# Altium schematic sheet LAN9254_B_P1.SchDoc
size 431 x 279 mm; DocumentNumber: 12; SheetNumber: 6; SheetTotal: 13
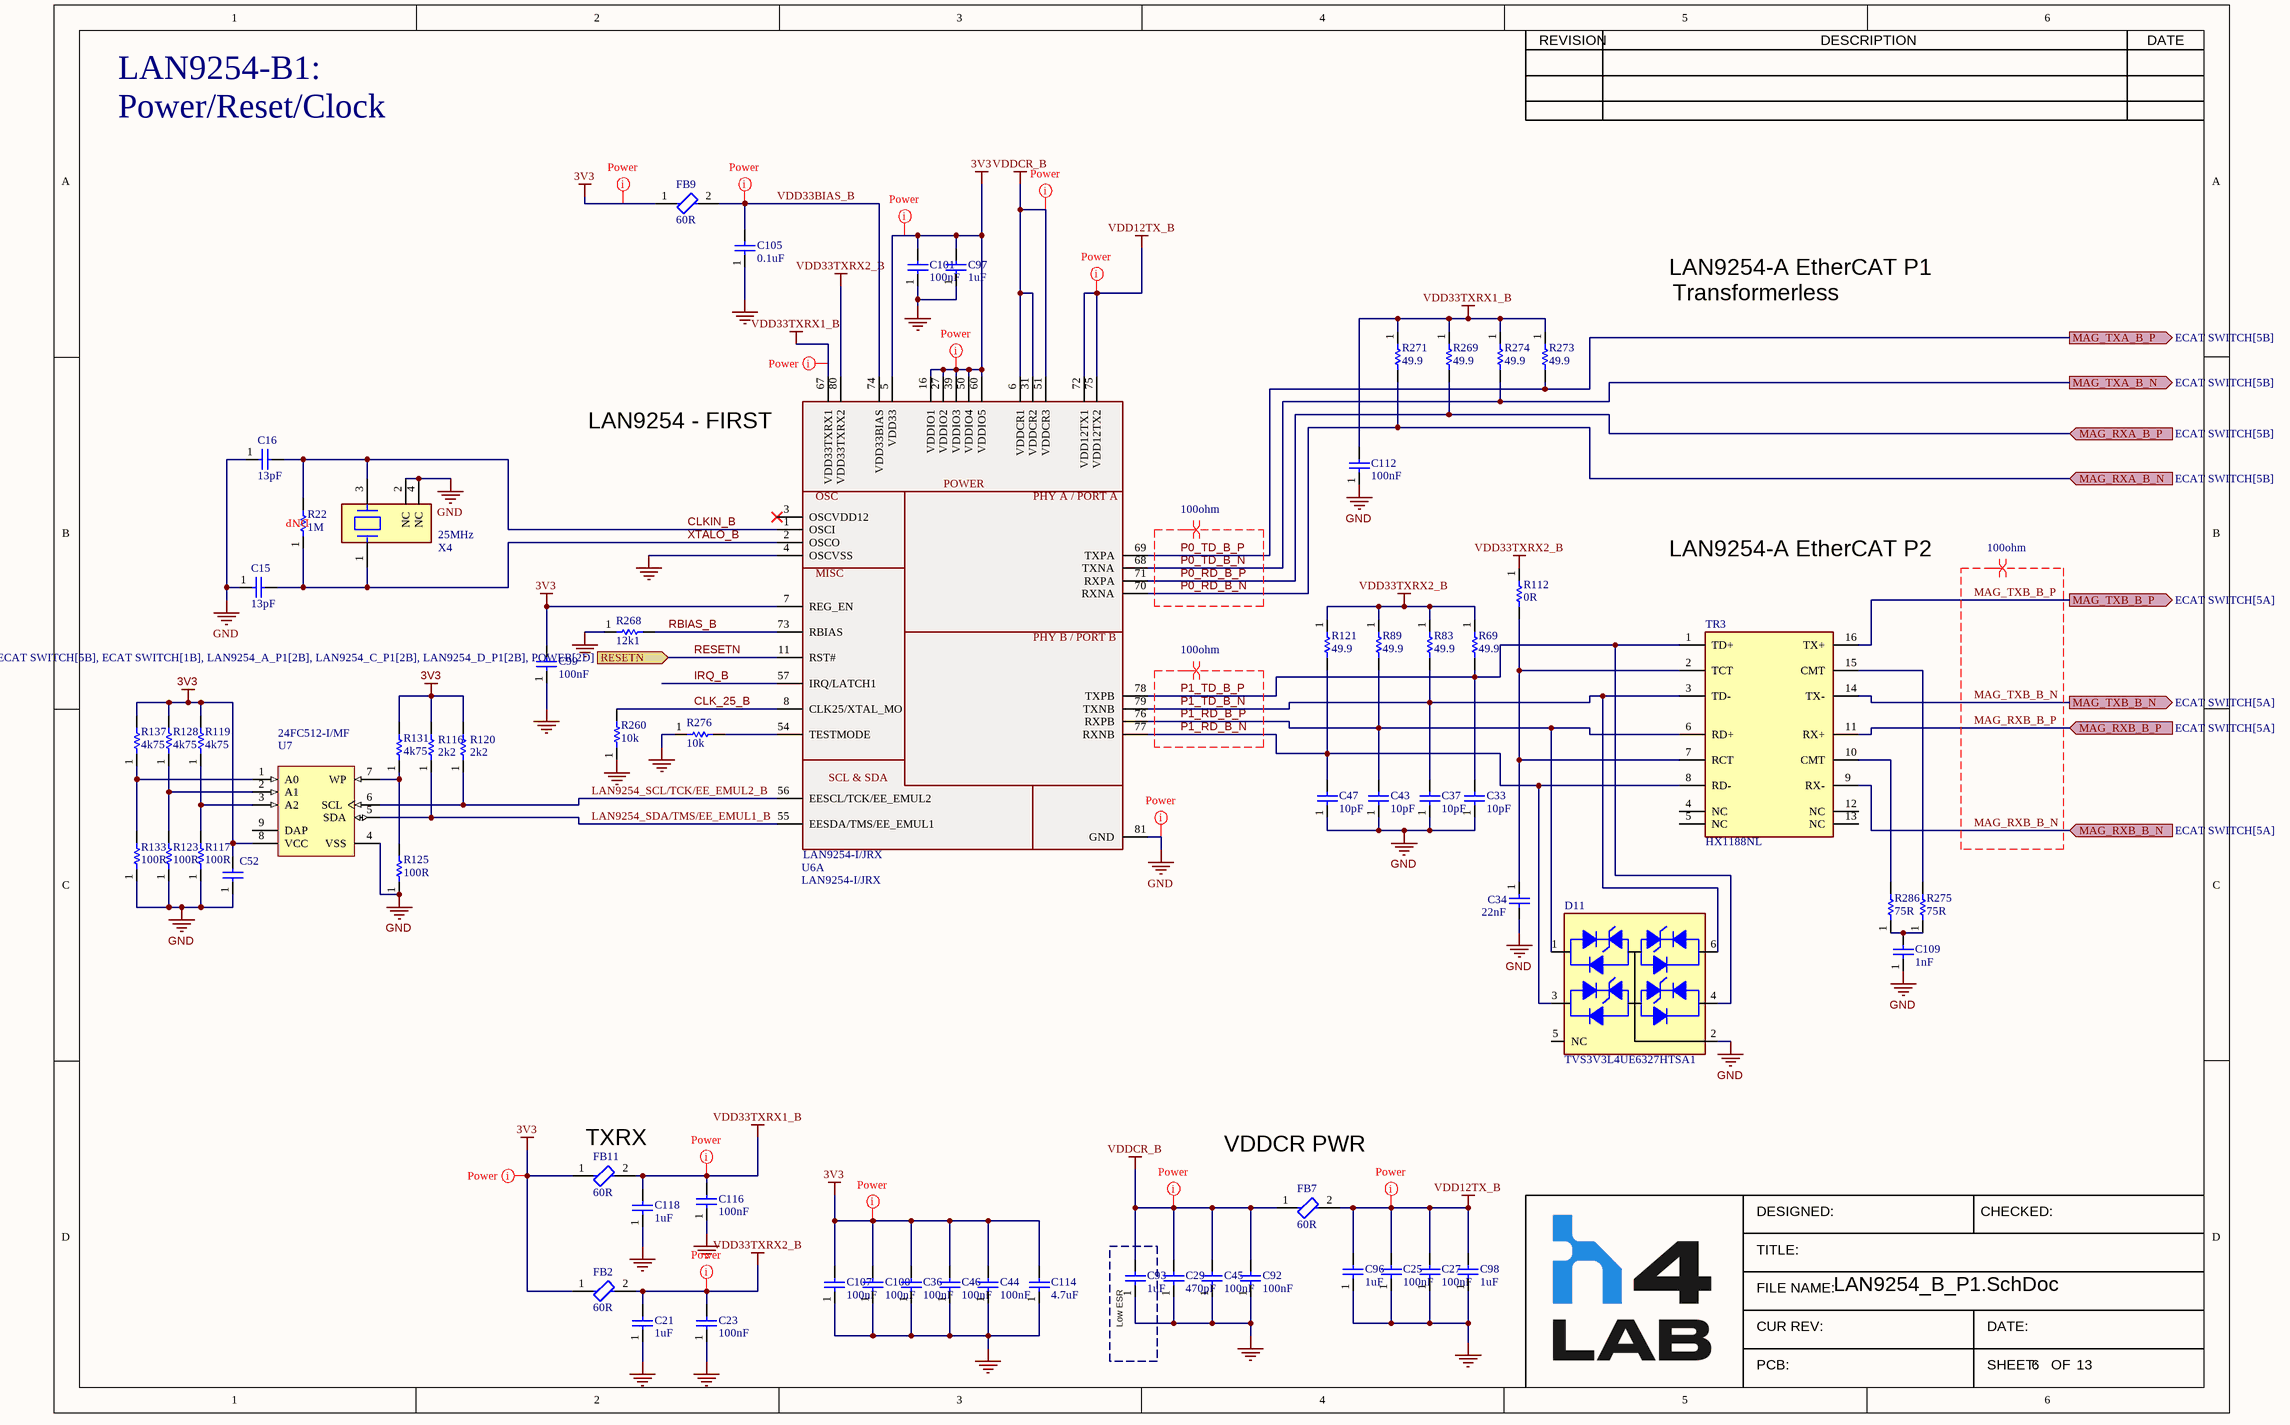
[diagram p0: LAN9254_B_P1.SchDoc]

## Parts
C15  value 13pF  [0402_C]  (hidden comment: GRM0225C1H130GA03L)
C16  value 13pF  [0402_C]  (hidden comment: GRM0225C1H130GA03L)
C21  value 1uF  [CAPC1608X09N(0603)]  (hidden comment: C0603C105K3PACTU)
C23  value 100nF  [CAPC1005X03N(0402)]  (hidden comment: GRM155R71C104JA88D)
C25  value 100nF  [CAPC1005X03N(0402)]  (hidden comment: GRM155R71C104JA88D)
C27  value 100nF  [CAPC1005X03N(0402)]  (hidden comment: GRM155R71C104JA88D)
C29  value 470pF  [CAPC1005X03N(0402)]  (hidden comment: GCM1555C1H471JA16D)
C33  value 10pF  [0402_C]  (hidden comment: C0402C100J5GAC7411)
C34  value 22nF  [CAPC1005X03N(0402)]  (hidden comment: GCM155R71H223KA55D)
C36  value 100nF  [CAPC1005X03N(0402)]  (hidden comment: GRM155R71C104JA88D)
C37  value 10pF  [0402_C]  (hidden comment: C0402C100J5GAC7411)
C43  value 10pF  [0402_C]  (hidden comment: C0402C100J5GAC7411)
C44  value 100nF  [CAPC1005X03N(0402)]  (hidden comment: GRM155R71C104JA88D)
C45  value 100nF  [CAPC1005X03N(0402)]  (hidden comment: GRM155R71C104JA88D)
C46  value 100nF  [CAPC1005X03N(0402)]  (hidden comment: GRM155R71C104JA88D)
C47  value 10pF  [0402_C]  (hidden comment: C0402C100J5GAC7411)
C52  GRM155R71C104JA88D  [CAPC1005X03N(0402)]  (value not drawn)
C92  value 100nF  [CAPC1005X03N(0402)]  (hidden comment: GRM155R71C104JA88D)
C93  value 1uF  [0603_C]  (hidden comment: LMK107BJ105KA-T)
C96  value 1uF  [CAPC1608X09N(0603)]  (hidden comment: C0603C105K3PACTU)
C97  value 1uF  [0603_C]  (hidden comment: LMK107BJ105KA-T)
C98  value 1uF  [CAPC1608X09N(0603)]  (hidden comment: C0603C105K3PACTU)
C99  value 100nF  [CAPC1005X03N(0402)]  (hidden comment: GRM155R71C104JA88D)
C100  value 100nF  [CAPC1005X03N(0402)]  (hidden comment: GRM155R71C104JA88D)
C101  value 100nF  [CAPC1005X03N(0402)]  (hidden comment: GRM155R71C104JA88D)
C105  value 0.1uF  [CAPC1608X09N(0603)]  (hidden comment: CL10B104KC8NNNC)
C107  value 100nF  [CAPC1005X03N(0402)]  (hidden comment: GRM155R71C104JA88D)
C109  value 1nF  [CAPC3216X16N(1206)]  (hidden comment: CC1206KKX7RDBB102)
C112  value 100nF  [CAPC1005X03N(0402)]  (hidden comment: GRM155R71C104JA88D)
C114  value 4.7uF  [CAPC3216X16N(1206)]  (hidden comment: CL31B475KBHNNNE)
C116  value 100nF  [CAPC1005X03N(0402)]  (hidden comment: GRM155R71C104JA88D)
C118  value 1uF  [CAPC1608X09N(0603)]  (hidden comment: C0603C105K3PACTU)
D11  TVS3V3L4UE6327HTSA1  [FP-SOT457-MFG]
FB2  Impedance: 60R  [FP-BKP2125-IPC_C]  (hidden comment: BKP2125HS600-T)
FB7  Impedance: 60R  [FP-BKP2125-IPC_C]  (hidden comment: BKP2125HS600-T)
FB9  Impedance: 60R  [FP-BKP2125-IPC_C]  (hidden comment: BKP2125HS600-T)
FB11  Impedance: 60R  [FP-BKP2125-IPC_C]  (hidden comment: BKP2125HS600-T)
R22  value 1M  [RESC1608X09N(0603)]  (hidden comment: RC0603FR-071ML)
R69  value 49.9  [RESC1005X06N(0402)]  (hidden comment: CRCW040249R9FKED)
R83  value 49.9  [RESC1005X06N(0402)]  (hidden comment: CRCW040249R9FKED)
R89  value 49.9  [RESC1005X06N(0402)]  (hidden comment: CRCW040249R9FKED)
R112  value 0R  [0402]  (hidden comment: RCS04020000Z0ED)
R116  value 2k2  [0402]  (hidden comment: CRCW04022K20JNED)
R117  value 100R  [0402]  (hidden comment: CRGCQ0402F100R)
R119  value 4k75  [RESC1005X06N(0402)]  (hidden comment: RC0402FR-074K75L)
R120  value 2k2  [0402]  (hidden comment: CRCW04022K20JNED)
R121  value 49.9  [RESC1005X06N(0402)]  (hidden comment: CRCW040249R9FKED)
R123  value 100R  [0402]  (hidden comment: CRGCQ0402F100R)
R125  value 100R  [0402]  (hidden comment: CRGCQ0402F100R)
R128  value 4k75  [RESC1005X06N(0402)]  (hidden comment: RC0402FR-074K75L)
R131  value 4k75  [RESC1005X06N(0402)]  (hidden comment: RC0402FR-074K75L)
R133  value 100R  [0402]  (hidden comment: CRGCQ0402F100R)
R137  value 4k75  [RESC1005X06N(0402)]  (hidden comment: RC0402FR-074K75L)
R260  value 10k  [RESC1005X06N(0402)]  (hidden comment: RC0402FR-0710KL)
R268  value 12k1  [RESC1005X06N(0402)]  (hidden comment: RC0402FR-0712K1L)
R269  value 49.9  [RESC1005X06N(0402)]  (hidden comment: CRCW040249R9FKED)
R271  value 49.9  [RESC1005X06N(0402)]  (hidden comment: CRCW040249R9FKED)
R273  value 49.9  [RESC1005X06N(0402)]  (hidden comment: CRCW040249R9FKED)
R274  value 49.9  [RESC1005X06N(0402)]  (hidden comment: CRCW040249R9FKED)
R275  value 75R  [RESC1005X06N(0402)]  (hidden comment: CRCW040275R0FKEDC)
R276  value 10k  [RESC1005X06N(0402)]  (hidden comment: RC0402FR-0710KL)
R286  value 75R  [RESC1005X06N(0402)]  (hidden comment: CRCW040275R0FKEDC)
TR3  HX1188NL  [FP-HX1188NL-MFG]
U6  LAN9254-I/JRX  [QFP50P1400X1400X120-81N]  (part A of 2)
U7  24FC512-I/MF  [DFNS-MF8]
X4  Frequency: 25MHz  [FP-XRCGB-MFG]  (hidden comment: XRCGB25M000F3A00R0)

## Blocks framed on the sheet
Low ESR: C93

## Ports
MAG_RXA_B_N (in, see ECAT SWITCH[5B]), MAG_RXA_B_P (in, see ECAT SWITCH[5B]), MAG_RXB_B_N (in, see ECAT SWITCH[5A]), MAG_RXB_B_P (in, see ECAT SWITCH[5A]), MAG_TXA_B_N (out, see ECAT SWITCH[5B]), MAG_TXA_B_P (out, see ECAT SWITCH[5B]), MAG_TXB_B_N (out, see ECAT SWITCH[5A]), MAG_TXB_B_P (out, see ECAT SWITCH[5A]), RESETN (in, see ECAT SWITCH[5B], ECAT SWITCH[1B], LAN9254_A_P1[2B], LAN9254_C_P1[2B], LAN9254_D_P1[2B], POWER[2D])

## Nets
3V3: C36.2 C44.2 C46.2 C52.2 C97.2 C99.2 C100.2 C101.2 C107.2 C114.2 FB2.1 FB9.1 FB11.1 R116.2 R119.2 R120.2 R128.2 R131.2 R137.2 U6.5(VDD33) U6.7(REG_EN) U6.16(VDDIO1) U6.27(VDDIO2) U6.39(VDDIO3) U6.50(VDDIO4) U6.60(VDDIO5) U7.8(VCC)
GND: C15.1 C16.1 C21.1 C23.1 C25.1 C27.1 C29.1 C33.1 C34.2 C36.1 C37.1 C43.1 C44.1 C45.1 C46.1 C47.1 C52.1 C92.1 C93.1 C96.1 C97.1 C98.1 C99.1 C100.1 C101.1 C105.1 C107.1 C109.1 C112.1 C114.1 C116.1 C118.1 D11.2(GND) R117.1 R123.1 R125.1 R133.1 R260.1 R268.1 R276.1 U6.4(OSCVSS) U6.81(GND) U7.4(VSS) X4.2(NC) X4.4(NC)
VDD12TX_B: C25.2 C27.2 C96.2 C98.2 FB7.2 U6.72(VDD12TX1) U6.75(VDD12TX2)
VDD33TXRX1_B: C112.2 C116.2 C118.2 FB11.2 R269.1 R271.1 R273.1 R274.1 U6.67(VDD33TXRX1)
VDD33TXRX2_B: C21.2 C23.2 FB2.2 R69.1 R83.1 R89.1 R112.1 R121.1 U6.80(VDD33TXRX2)
VDDCR_B: C29.2 C45.2 C92.2 C93.2 FB7.1 U6.6(VDDCR1) U6.31(VDDCR2) U6.51(VDDCR3)
CLK_25_B: R260.2 U6.8(CLK25/XTAL_MO)
CLKIN_B: C16.2 R22.2 U6.1(OSCI) X4.3
IRQ_B: U6.57(IRQ/LATCH1)
LAN9254_SCL/TCK/EE_EMUL2_B: R120.1 U6.56(EESCL/TCK/EE_EMUL2) U7.6(SCL)
LAN9254_SDA/TMS/EE_EMUL1_B: R116.1 U6.55(EESDA/TMS/EE_EMUL1) U7.5(SDA)
MAG_RXB_B_N: TR3.9(RX-) ; port MAG_RXB_B_N
MAG_RXB_B_P: TR3.11(RX+) ; port MAG_RXB_B_P
MAG_TXB_B_N: TR3.14(TX-) ; port MAG_TXB_B_N
MAG_TXB_B_P: TR3.16(TX+) ; port MAG_TXB_B_P
P0_RD_B_N: R271.2 U6.70(RXNA) ; port MAG_RXA_B_N
P0_RD_B_P: R269.2 U6.71(RXPA) ; port MAG_RXA_B_P
P0_TD_B_N: R274.2 U6.68(TXNA) ; port MAG_TXA_B_N
P0_TD_B_P: R273.2 U6.69(TXPA) ; port MAG_TXA_B_P
P1_RD_B_N: C47.2 D11.3 R121.2 TR3.8(RD-) U6.77(RXNB)
P1_RD_B_P: C43.2 D11.1 R89.2 TR3.6(RD+) U6.76(RXPB)
P1_TD_B_N: C37.2 D11.6 R83.2 TR3.3(TD-) U6.79(TXNB)
P1_TD_B_P: C33.2 D11.4 R69.2 TR3.1(TD+) U6.78(TXPB)
RBIAS_B: R268.2 U6.73(RBIAS)
RESETN: U6.11(RST#) ; port RESETN
VDD33BIAS_B: C105.2 FB9.2 U6.74(VDD33BIAS)
XTALO_B: C15.2 R22.1 U6.2(OSCO) X4.1
NetC34_1: C34.1 R112.2 TR3.2(TCT) TR3.7(RCT)
NetC109_2: C109.2 R275.1 R286.1
NetR117_2: R117.2 R119.1 U7.3(A2)
NetR123_2: R123.2 R128.1 U7.2(A1)
NetR125_2: R125.2 R131.1 U7.7(WP)
NetR133_2: R133.2 R137.1 U7.1(A0)
NetR275_2: R275.2 TR3.15(CMT)
NetR276_2: R276.2 U6.54(TESTMODE)
NetR286_2: R286.2 TR3.10(CMT)

Not connected (* = marked no-connect by the designer): D11 5(NC); TR3 4(NC) 5(NC) 12(NC) 13(NC); U6 3(OSCVDD12)*; U7 9(DAP)

## Layout directives
net class Power: 3V3, GND, VDD12TX_B, VDD33BIAS_B, VDD33TXRX1_B, VDD33TXRX2_B, VDDCR_B
differential pair; differential pair class 100ohm: MAG_RXB_B_N, MAG_RXB_B_P, MAG_TXB_B_N, MAG_TXB_B_P, P0_RD_B_N, P0_RD_B_P, P0_TD_B_N, P0_TD_B_P, P1_RD_B_N, P1_RD_B_P, P1_TD_B_N, P1_TD_B_P

## Notes on the sheet
- LAN9254-B1:
- Power/Reset/Clock
- Transformerless
- LAN9254-A EtherCAT P1
- (near U6) LAN9254 - FIRST
- (near R22) DNP
- LAN9254-A EtherCAT P2
- (near FB11) TXRX
- VDDCR PWR
- REVISION
- DESCRIPTION
- DATE
- DESIGNED:
- CHECKED:
- TITLE:
- FILE NAME:
- CUR REV:
- PCB:
- SHEET:
- DATE:
- OF
- (in symbol LAN9254-I/JRX, part A) POWER; OSC; PHY A / PORT A; MISC; PHY B / PORT B; SCL & SDA

## Library data of the parts
C15 C16 = 13pF_50V_0402_CAP_GRM0225C1H130GA03L: Cap Ceramic Monolithic 13pF 50VDC 2% SMD Emboss T/R; Manufacturer: Murata; Supplier 1: Digi-Key; Manufacturer Part Number: GRM0225C1H130GA03L; RoHS: Yes; Category: Ceramic Capacitors; Pricing 1: 40000=0.01108 (USD); RoHS Compliant: Yes; Supplier Part Number 1: 490-GRM0225C1H130GA03LTR-ND
C21 C96 C98 C118 = 1uF_25VDC_0603_Cap: MLCC - SMD/SMT 25volts 1uF X5R 10%; Voltage: 25VDC; Drawn By: TC; MPN: C0603C105K3PACTU; Tolerance: 10%; Supplier 1: Mouser; Supplier Part Number 1: 80-C0603C105K3PAC
C23 C25 C27 C36 C44-C46 C92 C99-C101 C107 C112 C116 = 100nF_16V_0402_CAP: CAP CER 0.1UF 16V X7R 0402; Tolerance: 5%; MPN: GRM155R71C104JA88D; Voltage Rating: 16V; Temp Coeff: X7R; Size/Package: 0402
C29 = 470pF_50V_0402_CAP: CAP CER 470PF 50V C0G/NP0 0402; Tolerance: 5%; Temp Coeff: C0G, NP0; MPN: GCM1555C1H471JA16D; Voltage: 50V; Size: 0402
C33 C37 C43 C47 = 10pF_50V_0402_C0402C100J5GAC7411: Cap Ceramic 10pF 50V C0G 5% SMD 0402 125°C Punched Paper T/R; Manufacturer: KEMET; Tolerance: 5%; Supplier 1: Digi-Key; Supplier Part Number 1: 399-C0402C100J5GAC7411CT-ND; Manufacturer Part Number: C0402C100J5GAC7411; RoHS: Yes; Category: Ceramic Capacitors; Stock 1: 39987; Pricing 1: 1=0.10000, 10=0.03500, 50=0.01940, 100=0.01580, 500=0.01128, 1000=0.00886, 2500=0.00805, 5000=0.00741 (USD); Case/Package: 0402; Dielectric Material: Ceramic; Min Operating Temperature: -55°C; Max Operating Temperature: 125°C; Packaging: Tape and Reel; Capacitance: 10pF; Dielectric: C0G; Voltage Rating (DC): 50V; Length: 1mm; Depth: 0.5mm; Lead Free: Lead Free; RoHS Compliant: Yes; ComponentLink1URL: http://components.arrow.com/part/dataview/0323_00309912?src-supplier=Arrow+Europe; ComponentLink1Description: http://components.arrow.com/part/dataview/0323_00309912?src-supplier=Arrow+Europe
C34 = 22nF_50V_0402_CAP: CAP CER 0.022UF 50V X7R 0402; Tolerance: 10%; MPN: GCM155R71H223KA55D; Voltage Rating: 50V; Temp Coeff: X7R; Size/Package: 0402; Mounting Type: Surface Mounting
C52 = 100nF_16V_0402_CAP: CAP CER 0.1UF 16V X7R 0402; Value: 100nF; Tolerance: 5%; MPN: GRM155R71C104JA88D; Voltage Rating: 16V; Temp Coeff: X7R; Size/Package: 0402
C93 C97 = 1uF_10V_low_ESR_0603_LMK107BJ105KA-T: Multilayer Ceramic Capacitors (High dielectric type), 10V, 1 uF, ± 10 %, 0603, X5R, RoHS; Manufacturer: Taiyo Yuden; Tolerance: 10%; Supplier 1: Digi-Key; Supplier Part Number 1: 587-4281-1-ND; Manufacturer Part Number: LMK107BJ105KA-T; RoHS: Yes; Category: Ceramic Capacitors; Stock 1: 254397; Pricing 1: 1=0.10000, 10=0.05800, 50=0.03180, 100=0.02590, 500=0.01852, 1000=0.01455 (USD); Mount: Surface Mount; Case/Package: 0603; Case Code (Imperial): 0603; Case Code (Metric): 1608; Min Operating Temperature: -55°C; Max Operating Temperature: 85°C; Packaging: Tape and Reel; Capacitance: 1uF; Voltage Rating (DC): 10V; Dielectric: X5R; Package Quantity: 4000; Voltage Rating: 10V; Termination: SMD/SMT; Resistor Type: Ceramic; Series: M; Construction: Flat; Length: 1.6mm; Width: 0.8mm; Height: 0.8mm; Thickness: 0.035inch; Depth: 0.8mm; Radiation Hardening: No; Lead Free: Lead Free; Halogen Free: Halogen Free; RoHS Compliant: Yes; ComponentLink1URL: https://datasheet.ciiva.com/11596/lmk107bj105ka-t-ss-11596793.pdf?src-supplier=Avnet; ComponentLink1Description: https://datasheet.ciiva.com/11596/lmk107bj105ka-t-ss-11596793.pdf?src-supplier=Avnet; ComponentLink2URL: https://datasheet.ciiva.com/15921/1054lmk107bj105ka-t-15921296.pdf?src-supplier=Onlinecomponents.com; ComponentLink2Description: https://datasheet.ciiva.com/15921/1054lmk107bj105ka-t-15921296.pdf?src-supplier=Onlinecomponents.com; ComponentLink3URL: https://datasheet.ciiva.com/26872/getdatasheetpartid-637529-26872638.pdf?src-supplier=Verical; ComponentLink3Description: https://datasheet.ciiva.com/26872/getdatasheetpartid-637529-26872638.pdf?src-supplier=Verical; ComponentLink4URL: https://datasheet.ciiva.com/30232/584lmk107bj105ka-t-30232760.pdf?src-supplier=Onlinecomponents.com; ComponentLink4Description: https://datasheet.ciiva.com/30232/584lmk107bj105ka-t-30232760.pdf?src-supplier=Onlinecomponents.com
C105 = 0.1uF_100V_0603_CAP: CAP CER 0.1UF 100V X7R 0603; Tolerance: 10%; MPN: CL10B104KC8NNNC; Supplier 1: Digi-Key; Supplier Part Number 1: 1276-6807-1-ND; Volage Rating: 100V; Temp Coefficent: X7R; Mounting Type: Surface Mount; Case/Package: 0603
C109 = 1nF_2kV_1206_CAP: CAP CER 1000PF 2KV X7R 1206; Tolerance: 10%; Voltage Rating: 2kV; MPN: CC1206KKX7RDBB102; Temp Coeff: X7R; Size/Package: 1206
C114 = 4.7uF_50V_1206_CAP: CAP CER 4.7UF 50V X7R 1206; Tolerance: 10%; MPN: CL31B475KBHNNNE; Voltage: 50V; Temp Coeff: X7R; Package/Case: 1206
D11 = TVS_DIODE_ETHERCAT_PHY_7.7V_20A_TVS3V3L4UE6327HTSA1: Trans Voltage Suppressor Diode, 3.3V V(RWM), Unidirectional, 4 Element, Silicon; Manufacturer: Infineon; Supplier: Digi-Key; Supplier Part Number: TVS3V3L4UE6327HTSA1CT-ND; Manufacturer Part Number: TVS3V3L4UE6327HTSA1; RoHS: Yes; Category: Diodes; Stock: 273244; Pricing: 1=0.54, 10=0.438, 100=0.2981, 500=0.22356, 1000=0.16767 (USD); Terminal Finish: Tin; Diode Type: TRANS VOLTAGE SUPPRESSOR; Moisture Sensitivity Level: 1; JESD-609 Code: e3; Reach SVHC Compliant: Yes; RoHS Compliant: Yes; ComponentLink1URL: https://datasheet.ciiva.com:443/pdfs/VipMasterIC/IC/INFN/INFNS19177/INFNS19177-1.pdf?src-supplier=IHS+Markit; ComponentLink1Description: https://datasheet.ciiva.com:443/pdfs/VipMasterIC/IC/INFN/INFNS19177/INFNS19177-1.pdf?src-supplier=IHS+Markit; ComponentLink2URL: http://www.farnell.com/datasheets/1945807.pdf?src-supplier=Farnell; ComponentLink2Description: http://www.farnell.com/datasheets/1945807.pdf?src-supplier=Farnell; ComponentLink3URL: http://www.mouser.com/ds/2/196/Infineon-TVS3V3L4U-DS-v02_04-en-469488.pdf?src-supplier=Mouser; ComponentLink3Description: http://www.mouser.com/ds/2/196/Infineon-TVS3V3L4U-DS-v02_04-en-469488.pdf?src-supplier=Mouser; ComponentLink4URL: http://www.farnell.com/datasheets/1945807.pdf?src-supplier=Element14; ComponentLink4Description: http://www.farnell.com/datasheets/1945807.pdf?src-supplier=Element14; ComponentLink5URL: http://www.farnell.com/datasheets/1945807.pdf?src-supplier=Newark; ComponentLink5Description: http://www.farnell.com/datasheets/1945807.pdf?src-supplier=Newark; ComponentLink6URL: http://www.infineon.com/dgdl/Infineon-TVS3V3L4U-DS-v02_04-en.pdf?fileId=db3a3043382e837301385be7912532ed&src-supplier=Avnet; ComponentLink6Description: http://www.infineon.com/dgdl/Infineon-TVS3V3L4U-DS-v02_04-en.pdf?fileId=db3a3043382e837301385be7912532ed&src-supplier=Avnet; ComponentLink7URL: https://www.infineon.com/dgdl/TVS3V3L4U_rev_2_2.pdf?folderId=db3a30431f848401011fcbf2ab4c04c4&fileId=db3a3043382e837301385be7912532ed&src-supplier=Digi-Key; ComponentLink7Description: https://www.infineon.com/dgdl/TVS3V3L4U_rev_2_2.pdf?folderId=db3a30431f848401011fcbf2ab4c04c4&fileId=db3a3043382e837301385be7912532ed&src-supplier=Digi-Key; ComponentLink8URL: https://www.infineon.com/dgdl/TVS3V3L4U_rev_2_2.pdf?folderId=db3a30431f848401011fcbf2ab4c04c4&amp;fileId=db3a3043382e837301385be7912532ed&src-supplier=Digi-Key; ComponentLink8Description: https://www.infineon.com/dgdl/TVS3V3L4U_rev_2_2.pdf?folderId=db3a30431f848401011fcbf2ab4c04c4&amp;fileId=db3a3043382e837301385be7912532ed&src-supplier=Digi-Key
FB2 FB7 FB9 FB11 = 60R_100Mhz_0805_3A: TAIYO YUDEN - BKP2125HS600-T - Ferrite Bead, 0805 [2012 Metric], 60 ohm, 3 A, BKP Series, 0.025 ohm, ± 25%; Max DC Current: 3A; Number of Lines: 1; DC Resistance (DCR): 25mR; Test Frequency: 100MHz; Shielding: Unshielded; Packaging: Tape and Reel; Case Code (Imperial): 0805; Series: BK; Package Quantity: 1; Tolerance: 25%; Lead Free: Lead Free; Number of Pins: 2; Max Current Rating: 3A; Length: 2.3mm; Case/Package: 0805; Max Operating Temperature: 85°C; Min Operating Temperature: -55°C; Core Material: Ferrite; Case Code (Metric): 2125; Depth: 1.45mm; Resistance: 25mR; Halogen Free: Halogen Free; Termination: SMD/SMT; Width: 0.049inch; RoHS Compliant: Yes; Mount: Surface Mount; Height: 1.05mm; Supplier 1: Digi-Key; Manufacturer: Taiyo Yuden; Manufacturer Part Number: BKP2125HS600-T; RoHS: Yes; Category: Inductors; Stock 1: 308405; Pricing 1: 1=0,12000, 10=0,09400, 25=0,08480, 50=0,06200, 100=0,05360, 250=0,04232, 500=0,03574, 1000=0,03010 (USD); REACH SVHC: Unknown; ComponentLink1URL: https://datasheet.ciiva.com/6213/bkp2125hs600-t-ss-6213090.pdf?src-supplier=Digi-Key; ComponentLink1Description: https://datasheet.ciiva.com/6213/bkp2125hs600-t-ss-6213090.pdf?src-supplier=Digi-Key; ComponentLink2URL: https://datasheet.ciiva.com/30063/884bkp2125hs600-t-30063956.pdf?src-supplier=Onlinecomponents.com; ComponentLink2Description: https://datasheet.ciiva.com/30063/884bkp2125hs600-t-30063956.pdf?src-supplier=Onlinecomponents.com; ComponentLink3URL: https://datasheet.ciiva.com/6213/mlci08-e-6213094.pdf?src-supplier=Digi-Key; ComponentLink3Description: https://datasheet.ciiva.com/6213/mlci08-e-6213094.pdf?src-supplier=Digi-Key; ComponentLink4URL: https://datasheet.ciiva.com/6213/mlci08-e-6213097.pdf?src-supplier=Digi-Key; ComponentLink4Description: https://datasheet.ciiva.com/6213/mlci08-e-6213097.pdf?src-supplier=Digi-Key; Supplier Part Number 1: 587-1932-1-ND
R22 = 1M_1/10W_RES_0603: RES SMD 1M OHM 1% 1/10W 0603; MPN: RC0603FR-071ML; Tolerance: 1%; Power: 1/10W; Size: 0603; Supplier 1: Digi-Key; Supplier Part Number 1: 311-1.00MHRCT-ND
R69 R83 R89 R121 R269 R271 R273 R274 = 49R9_1/10W_0402_RES: RES SMD 49.9 OHM 1% 1/16W 0402; MPN: CRCW040249R9FKED; Wattage: 1/16W; Drawn By: TC; Tolerance: 1%; Supplier 1: Digi-Key; Supplier Part Number 1: 541-49.9LCT-ND
R112 = 0R_1/5W_0402_RCS04020000Z0ED_RES: VISHAY - RCS04020000Z0ED - SMD Chip Resistor, 0402 [1005 Metric], 0 ohm, RCS Series, 50 V, Thick Film, 200 mW; Manufacturer: Vishay Dale; Resistance: 0mR; Max Power Dissipation: 200mW; Supplier 1: Digi-Key; Supplier Part Number 1: 541-2877-1-ND; Manufacturer Part Number: RCS04020000Z0ED; RoHS: Yes; Category: Chip SMD Resistors; Stock 1: 18214; Pricing 1: 1=0.10000, 10=0.08300, 25=0.05760, 50=0.04480, 100=0.03200, 250=0.02496, 500=0.01984, 1000=0.01408, 5000=0.01088 (USD); Case/Package: 0402; Case Code (Metric): 1005; Case Code (Imperial): 0402; Min Operating Temperature: -55°C; Max Operating Temperature: 155°C; Packaging: Tape and Reel; Resistor Type: Thick Film; Number of Terminations: 2; Features: Automotive AEC-Q200; Length: 0.039inch; Width: 0.02inch; Height: 0.016inch; RoHS Compliant: Yes; ComponentLink1URL: http://www.farnell.com/datasheets/2618474.pdf?src-supplier=Farnell; ComponentLink1Description: http://www.farnell.com/datasheets/2618474.pdf?src-supplier=Farnell; ComponentLink2URL: http://www.vishay.com/docs/20065/rcse3.pdf?src-supplier=Digi-Key; ComponentLink2Description: http://www.vishay.com/docs/20065/rcse3.pdf?src-supplier=Digi-Key; ComponentLink3URL: http://www.farnell.com/datasheets/2618474.pdf?src-supplier=Element14; ComponentLink3Description: http://www.farnell.com/datasheets/2618474.pdf?src-supplier=Element14; ComponentLink4URL: http://www.farnell.com/datasheets/2618474.pdf?src-supplier=Newark; ComponentLink4Description: http://www.farnell.com/datasheets/2618474.pdf?src-supplier=Newark
R116 R120 = 2k2_1/16_0402_CRCW04022K20JNED_RES: Vishay CRCW Series Thick Film Resistor 0402 Case 2.2k 5% 0.063W 200ppm/K; Manufacturer: Vishay Dale; Resistance: 2.2kR; Temperature Coefficient: 200ppm/°C; Max Power Dissipation: 63mW; Voltage Rating: 50V; Tolerance: 5%; Supplier 1: Digi-Key; Manufacturer Part Number: CRCW04022K20JNED; RoHS: Yes; Category: Chip SMD Resistors; Stock 1: 5003; Pricing 1: 1=0,10000, 10=0,03300, 100=0,01360, 1000=0,00610, 2500=0,00529, 5000=0,00437 (USD); Mount: Surface Mount; Case/Package: 0402; Case Code (Imperial): 0402; Case Code (Metric): 1005; Contact Plating: Tin; Weight: 2.3E-05oz; Size Code: 0402; Min Operating Temperature: -55°C; Max Operating Temperature: 155°C; Resistor Type: Thick Film; Packaging: Tape and Reel; Number of Terminations: 2; Power Rating: 63mW; Package Quantity: 1; Features: Automotive AEC-Q200; Termination: SMD/SMT; Voltage Rating (DC): 50V; Series: CRCW; Resistance Tolerance: 5%; Construction: Rectangular; Technology: THICK FILM; Length: 1mm; Width: 0.5mm; Height: 0.35mm; Depth: 0.5mm; Radiation Hardening: No; RoHS Compliant: Yes; Lead Free: Lead Free; REACH SVHC: Unknown; Military Standard: Not; ComponentLink1URL: https://datasheet.ciiva.com/5542/dcrcwe3-109170-5542006.pdf?src-supplier=Mouser; ComponentLink1Description: https://datasheet.ciiva.com/5542/dcrcwe3-109170-5542006.pdf?src-supplier=Mouser; ComponentLink2URL: https://datasheet.ciiva.com/3256/dcrcwe3-3256342.pdf?src-supplier=Avnet; ComponentLink2Description: https://datasheet.ciiva.com/3256/dcrcwe3-3256342.pdf?src-supplier=Avnet; ComponentLink3URL: https://datasheet.ciiva.com/3256/dcrcwe3-3256343.pdf?src-supplier=Avnet; ComponentLink3Description: https://datasheet.ciiva.com/3256/dcrcwe3-3256343.pdf?src-supplier=Avnet; ComponentLink4URL: https://datasheet.ciiva.com/2462/dcrcwe3-2462040.pdf?src-supplier=Digi-Key; ComponentLink4Description: https://datasheet.ciiva.com/2462/dcrcwe3-2462040.pdf?src-supplier=Digi-Key; ComponentLink5URL: https://datasheet.ciiva.com/2462/dcrcwe3-2462041.pdf?src-supplier=Digi-Key; ComponentLink5Description: https://datasheet.ciiva.com/2462/dcrcwe3-2462041.pdf?src-supplier=Digi-Key; ComponentLink6URL: https://datasheet.ciiva.com/2462/dcrcwe3-2462042.pdf?src-supplier=Digi-Key; ComponentLink6Description: https://datasheet.ciiva.com/2462/dcrcwe3-2462042.pdf?src-supplier=Digi-Key; ComponentLink7URL: https://datasheet.ciiva.com/16760/70201119-16760139.pdf?src-supplier=Allied+Electronics; ComponentLink7Description: https://datasheet.ciiva.com/16760/70201119-16760139.pdf?src-supplier=Allied+Electronics; ComponentLink8URL: https://datasheet.ciiva.com/16436/dcrcwe3-16436154.pdf?src-supplier=Future+Electronics; ComponentLink8Description: https://datasheet.ciiva.com/16436/dcrcwe3-16436154.pdf?src-supplier=Future+Electronics; ComponentLink9URL: https://datasheet.ciiva.com/7743/dcrcwe3-7743566.pdf?src-supplier=Element14; ComponentLink9Description: https://datasheet.ciiva.com/7743/dcrcwe3-7743566.pdf?src-supplier=Element14; Supplier Part Number 1: 541-2.2KJCT-ND
R117 R123 R125 R133 = 100R_1/16_0402_RES: Res Thick Film 0402 100 Ohm 1% 0.063W(1/16W) ±200ppm/C Pad SMD Automotive T/R; Manufacturer: TE Connectivity; Max Power Dissipation: 63mW; Temperature Coefficient: 200ppm/°C; Supplier 1: Digi-Key; Manufacturer Part Number: CRGCQ0402F100R; RoHS: Yes; Category: Chip SMD Resistors; Stock 1: 151133; Pricing 1: 1=0.10000, 10=0.02600, 100=0.01040, 1000=0.00466, 2500=0.00405, 5000=0.00334 (USD); Case/Package: 0402; Case Code (Imperial): 0402; Case Code (Metric): 1005; Min Operating Temperature: -55°C; Max Operating Temperature: 155°C; Resistor Type: Thick Film; Features: Moisture Resistant,Automotive AEC-Q200; Packaging: Cut Tape; Resistance: 100R; Tolerance: 1%; Number of Terminations: 2; RoHS Compliant: Yes; ComponentLink1URL: https://www.te.com/commerce/DocumentDelivery/DDEController?Action=srchrtrv&amp;DocNm=1773204-3&amp;DocType=DS&amp;DocLang=English&src-supplier=Digi-Key; ComponentLink1Description: https://www.te.com/commerce/DocumentDelivery/DDEController?Action=srchrtrv&amp;DocNm=1773204-3&amp;DocType=DS&amp;DocLang=English&src-supplier=Digi-Key; ComponentLink2URL: https://4donline.ihs.com/images/VipMasterIC/IC/TYEL/TYEL-S-A0004929575/TYEL-S-A0004929575-1.pdf?hkey=52A5661711E402568146F3353EA87419&src-supplier=Element14; ComponentLink2Description: https://4donline.ihs.com/images/VipMasterIC/IC/TYEL/TYEL-S-A0004929575/TYEL-S-A0004929575-1.pdf?hkey=52A5661711E402568146F3353EA87419&src-supplier=Element14; ComponentLink3URL: https://4donline.ihs.com/images/VipMasterIC/IC/TYEL/TYEL-S-A0004929575/TYEL-S-A0004929575-1.pdf?hkey=52A5661711E402568146F3353EA87419&src-supplier=Newark; ComponentLink3Description: https://4donline.ihs.com/images/VipMasterIC/IC/TYEL/TYEL-S-A0004929575/TYEL-S-A0004929575-1.pdf?hkey=52A5661711E402568146F3353EA87419&src-supplier=Newark; ComponentLink4URL: https://4donline.ihs.com/images/VipMasterIC/IC/TYEL/TYEL-S-A0004929575/TYEL-S-A0004929575-1.pdf?hkey=52A5661711E402568146F3353EA87419&src-supplier=Farnell; ComponentLink4Description: https://4donline.ihs.com/images/VipMasterIC/IC/TYEL/TYEL-S-A0004929575/TYEL-S-A0004929575-1.pdf?hkey=52A5661711E402568146F3353EA87419&src-supplier=Farnell; Supplier Part Number 1: A129615CT-ND
R119 R128 R131 R137 = 4k75_1/16_0402_RES: RES SMD 4.75K OHM 1% 1/16W 0402; Power: 1/16; MPN: RC0402FR-074K75L; Tolerance: 1%; Package/Case: 0402
R260 R276 = 10k_1/16W_0402_RES: RES SMD 10K OHM 1% 1/16W 0402; Tolerance: 1%; Power: 1/16W; Size: 0402; MPN: RC0402FR-0710KL
R268 = 12k1_1/16W-0402_RES: RES SMD 12.1K OHM 1% 1/16W 0402; MPN: RC0402FR-0712K1L; Tolerance: 1%; Power: 1/16W; Case/Package: 0402
R275 R286 = 75R_1/10W_0402_RES: RES SMD 75 OHM 1% 1/16W 0402; Tolerance: +/-1%; MPN: CRCW040275R0FKEDC; Wattage: 1/16W; Drawn By: TC; Size/Package: 0402
TR3 = HX1188NL_TRANSFO_LAN_-40-85DEG: Datacom Transformer, GENERAL PURPOSE Application(s), 1:1; 1:1; Manufacturer: Pulse; Isolation Voltage: 1.65kV; Channels: 1; Primary Inductance: 350uH; Manufacturer Part Number: HX1188NL; RoHS: Yes; Category: Transformers; Min Operating Temperature: -40°C; Max Operating Temperature: 85°C; Turns Ratio: 1:1; Packaging: Rail/Tube; Length: 12.7mm; Width: 7.11mm; Height: 5.97mm; RoHS Compliant: Yes; ComponentLink1URL: https://datasheet.ciiva.com:443/pdfs/VipMasterIC/IC/PLEI/PLEI-S-A0005794621/PLEI-S-A0005794621-1.pdf?src-supplier=IHS+Markit; ComponentLink1Description: https://datasheet.ciiva.com:443/pdfs/VipMasterIC/IC/PLEI/PLEI-S-A0005794621/PLEI-S-A0005794621-1.pdf?src-supplier=IHS+Markit; Supplier: Digi-Key; Supplier Part Number: 553-1340-5-ND; Stock: 14377; Pricing: 1=5.68, 10=4.314, 25=4.2004, 50=3.86, 100=3.6329, 250=3.5194, 500=3.40588, 1000=3.29234 (USD); Mounting Technology: Surface Mount; Terminal Finish: Nickel; Application(s): GENERAL PURPOSE; Transformer Type: DATACOM TRANSFORMER; JESD-609 Code: e3; Reach SVHC Compliant: Yes; ComponentLink2URL: https://datasheet.ciiva.com/2938/+hj603-2938785.pdf?src-supplier=Digi-Key; ComponentLink2Description: https://datasheet.ciiva.com/2938/+hj603-2938785.pdf?src-supplier=Digi-Key
U6 = LAN9254-I/JRX: 2/3-PORT Ethercat Slave Controller With 32 Digios With Integrated Ethernet Phys; Manufacturer: Microchip; Supplier 1: Digi-Key; Manufacturer Part Number: LAN9254-I/JRX; RoHS: Yes; Pricing 1: 1=14.24000, 25=12.99000 (USD); RoHS Compliant: Yes; Supplier Part Number 1: 150-LAN9254-I/JRX-ND
U7 = EEPROM_512kb_1MHz_24FC512-I/MF: EEPROM Serial-2Wire 512K-bit 64K x 8 1.8V/2.5V/3.3V/5V 8-Pin DFN-S EP Tube; Manufacturer: Microchip; Interface: I2C,Serial; Frequency: 400kHz; Min Supply Voltage: 1.7V; Max Supply Voltage: 5.5V; Access Time: 400ns; Nominal Supply Current: 5mA; Density: 512Kb; Max Frequency: 1MHz; Organization: 64KX8; Access Time-Max: 900ns; Write Protection: YES; Write Cycle Time-Max (tWC): 5ms; Supplier 1: Digi-Key; Manufacturer Part Number: 24FC512-I/MF; RoHS: Yes; Category: EEPROM; Pricing 1: 1=2.16000 (USD); Mount: Surface Mount; Number of Pins: 8; Contact Plating: Tin,Matte; Min Operating Temperature: -40°C; Max Operating Temperature: 85°C; Packaging: Rail/Tube; Memory Type: EEPROM; Package Quantity: 60; Memory Size: 512Kb; Supply Current: 5mA; REACH SVHC: No SVHC; Lead Free: Lead Free; RoHS Compliant: Yes; ComponentLink1URL: https://datasheet.ciiva.com/3185/21754m-3185247.pdf?src-supplier=Avnet; ComponentLink1Description: https://datasheet.ciiva.com/3185/21754m-3185247.pdf?src-supplier=Avnet; Supplier Part Number 1: 24FC512-I/MF-ND; Case/Package: DFN; Programming Voltage: 5.5V; Supply Voltage-Nom: 5.5V; Radiation Hardening: No; ComponentLink2URL: https://datasheet.ciiva.com/16321/filehandler-aspxddocname-en546203-16321085.pdf?src-supplier=Future+Electronics; ComponentLink2Description: https://datasheet.ciiva.com/16321/filehandler-aspxddocname-en546203-16321085.pdf?src-supplier=Future+Electronics
X4 = 25MHz_Crystal_2016_35PPM_XRCGB25M000F3A00R0: Crystal 25MHz ±30ppm (Tol) ±35ppm (Stability) 6pF 100Ohm Automotive 4-Pin SMD T/R; Manufacturer: Murata; ESR (Equivalent Series Resistance): 100R; Frequency Stability: 100ppm; Load Capacitance: 6pF; Supplier 1: Digi-Key; Manufacturer Part Number: XRCGB25M000F3A00R0; RoHS: Yes; Category: Crystals; Stock 1: 53614; Pricing 1: 1=0.56000, 10=0.46300, 50=0.41640, 100=0.37010, 500=0.35156, 1000=0.29605 (USD); Mount: Surface Mount; Case/Package: SMD/SMT; Min Operating Temperature: -40°C; Max Operating Temperature: 125°C; Packaging: Tape and Reel; Frequency Tolerance: 35ppm; Length: 0.079inch; Width: 0.063inch; Height: 0.028inch; Ratings: AEC-Q200; RoHS Compliant: Yes; ComponentLink1URL: http://www.farnell.com/datasheets/2631968.pdf?src-supplier=Farnell; ComponentLink1Description: http://www.farnell.com/datasheets/2631968.pdf?src-supplier=Farnell; ComponentLink2URL: http://www.murata.com/~/media/webrenewal/products/timingdevice/crystalu/flyers/vppt-hcrj126-d.ashx?la=en&src-supplier=Digi-Key; ComponentLink2Description: http://www.murata.com/~/media/webrenewal/products/timingdevice/crystalu/flyers/vppt-hcrj126-d.ashx?la=en&src-supplier=Digi-Key; ComponentLink3URL: https://www.murata.com/~/media/webrenewal/products/timingdevice/crystalu/flyers/vppt-hcrj126-d.ashx?la=en&src-supplier=Digi-Key; ComponentLink3Description: https://www.murata.com/~/media/webrenewal/products/timingdevice/crystalu/flyers/vppt-hcrj126-d.ashx?la=en&src-supplier=Digi-Key; ComponentLink4URL: http://www.farnell.com/datasheets/2631968.pdf?src-supplier=Newark; ComponentLink4Description: http://www.farnell.com/datasheets/2631968.pdf?src-supplier=Newark; Supplier Part Number 1: 490-12146-1-ND